# Altium schematic sheet Power Management.SchDoc
size A
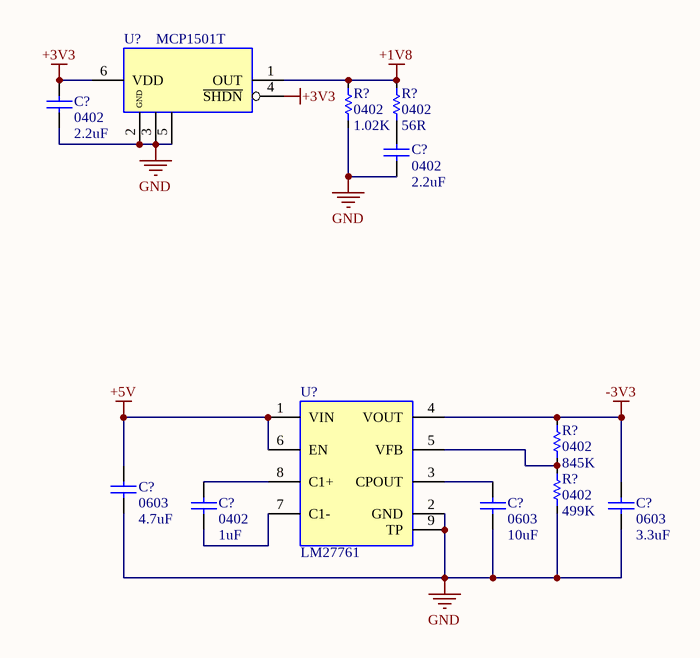
[diagram p0: Power Management.SchDoc]

## Parts
(Parts that share a designator on the sheet are numbered #1, #2 ... from top to bottom, then left to right.)
C?#1  value 2.2uF  PackageDescription: 0402  [CAPC3225X16N]  (hidden comment: Cap)
C?#2  value 2.2uF  PackageDescription: 0402  [CAPC3225X16N]  (hidden comment: Cap)
C?#3  value 4.7uF  PackageDescription: 0603  [CAPC3225X16N]  (hidden comment: Cap)
C?#4  value 1uF  PackageDescription: 0402  [CAPC3225X16N]  (hidden comment: Cap)
C?#5  value 10uF  PackageDescription: 0603  [CAPC3225X16N]  (hidden comment: Cap)
C?#6  value 3.3uF  PackageDescription: 0603  [CAPC3225X16N]  (hidden comment: Cap)
R?#1  value 1.02K  PackageDescription: 0402  [RESC2012X06N]  (hidden comment: Res)
R?#2  value 56R  PackageDescription: 0402  [RESC2012X06N]  (hidden comment: Res)
R?#3  value 845K  PackageDescription: 0402  [RESC2012X06N]  (hidden comment: Res)
R?#4  value 499K  PackageDescription: 0402  [RESC2012X06N]  (hidden comment: Res)
U?#1  MCP1501T  [SOT95P285X130-6L]
U?#2  LM27761  [SON50P200X80_HS-9N]

## Nets
+1V8: R?#1.1 R?#2.1 U?#1.1(OUT)
+3V3: C?#1.2 U?#1.4(~{SHDN}) U?#1.6(VDD)
+5V: C?#3.2 U?#2.1(VIN) U?#2.6(EN)
-3V3: C?#6.2 R?#3.1 U?#2.4(VOUT)
GND: C?#1.1 C?#2.1 C?#3.1 C?#5.1 C?#6.1 R?#1.2 R?#4.2 U?#1.2(GND) U?#1.3(GND2) U?#1.5(GND3) U?#2.2(GND) U?#2.9(TP)
NetC?#2_2: C?#2.2 R?#2.2
NetC?#4_1: C?#4.1 U?#2.7(C1-)
NetC?#4_2: C?#4.2 U?#2.8(C1+)
NetC?#5_2: C?#5.2 U?#2.3(CPOUT)
NetR?#3_2: R?#3.2 R?#4.1 U?#2.5(VFB)

## Library data of the parts
C?#1-C?#6 = Cap: Capacitor
R?#1-R?#4 = Res: Resistor; Published: 8-Jun-2000; LatestRevisionDate: 17-Jul-2002; LatestRevisionNote: Re-released for DXP Platform.; PackageReference: AXIAL-0.3
U?#1 = MCP1501T-18E_CHY: Voltage References Precision Buffered Voltage Reference; Manufacturer_Name: Microchip; Manufacturer_Part_Number: MCP1501T-18E/CHY; Geometry.Height: 1.45mm; Mouser Part Number: 579-MCP1501T-18E/CHY; Mouser Price/Stock: https://www.mouser.com/Search/Refine.aspx?Keyword=579-MCP1501T-18E%2FCHY; RS Part Number: *; RS Price/Stock: *; Datasheet Link: http://ww1.microchip.com/downloads/en/DeviceDoc/20005474E.pdf; Supplier 1: Digi-Key; Supplier Part Number 1: MCP1501T-18E/CHYCT-ND
U?#2 = LM27761: Charge pump voltage inverter; Supplier 1: Digi-Key; Supplier Part Number 1: 296-43882-1-ND